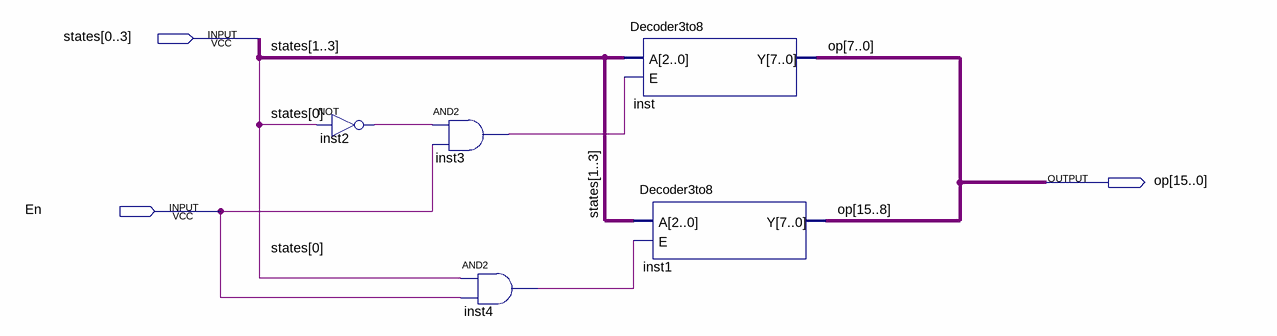
[diagram p0: schematic sheet]
// Quartus schematic 4to16decoder.bdf as structural Verilog: 5 symbols, 3 pins
module \4to16decoder  (
  input  [0:3] states,
  input  En,
  output [15:0] op
);

  wire inst2_out, inst3_out, inst4_out;

  not inst2 (inst2_out, states[0]);
  and inst3 (inst3_out, inst2_out, En);
  and inst4 (inst4_out, states[0], En);
  Decoder3to8 inst (.A(states[1:3]), .E(inst3_out), .Y(op[7:0]));
  Decoder3to8 inst1 (.A(states[1:3]), .E(inst4_out), .Y(op[15:8]));
endmodule
